# EAGLE design SparkFunVKeyVoltageKeypad2 (EAGLE 7.4.0)
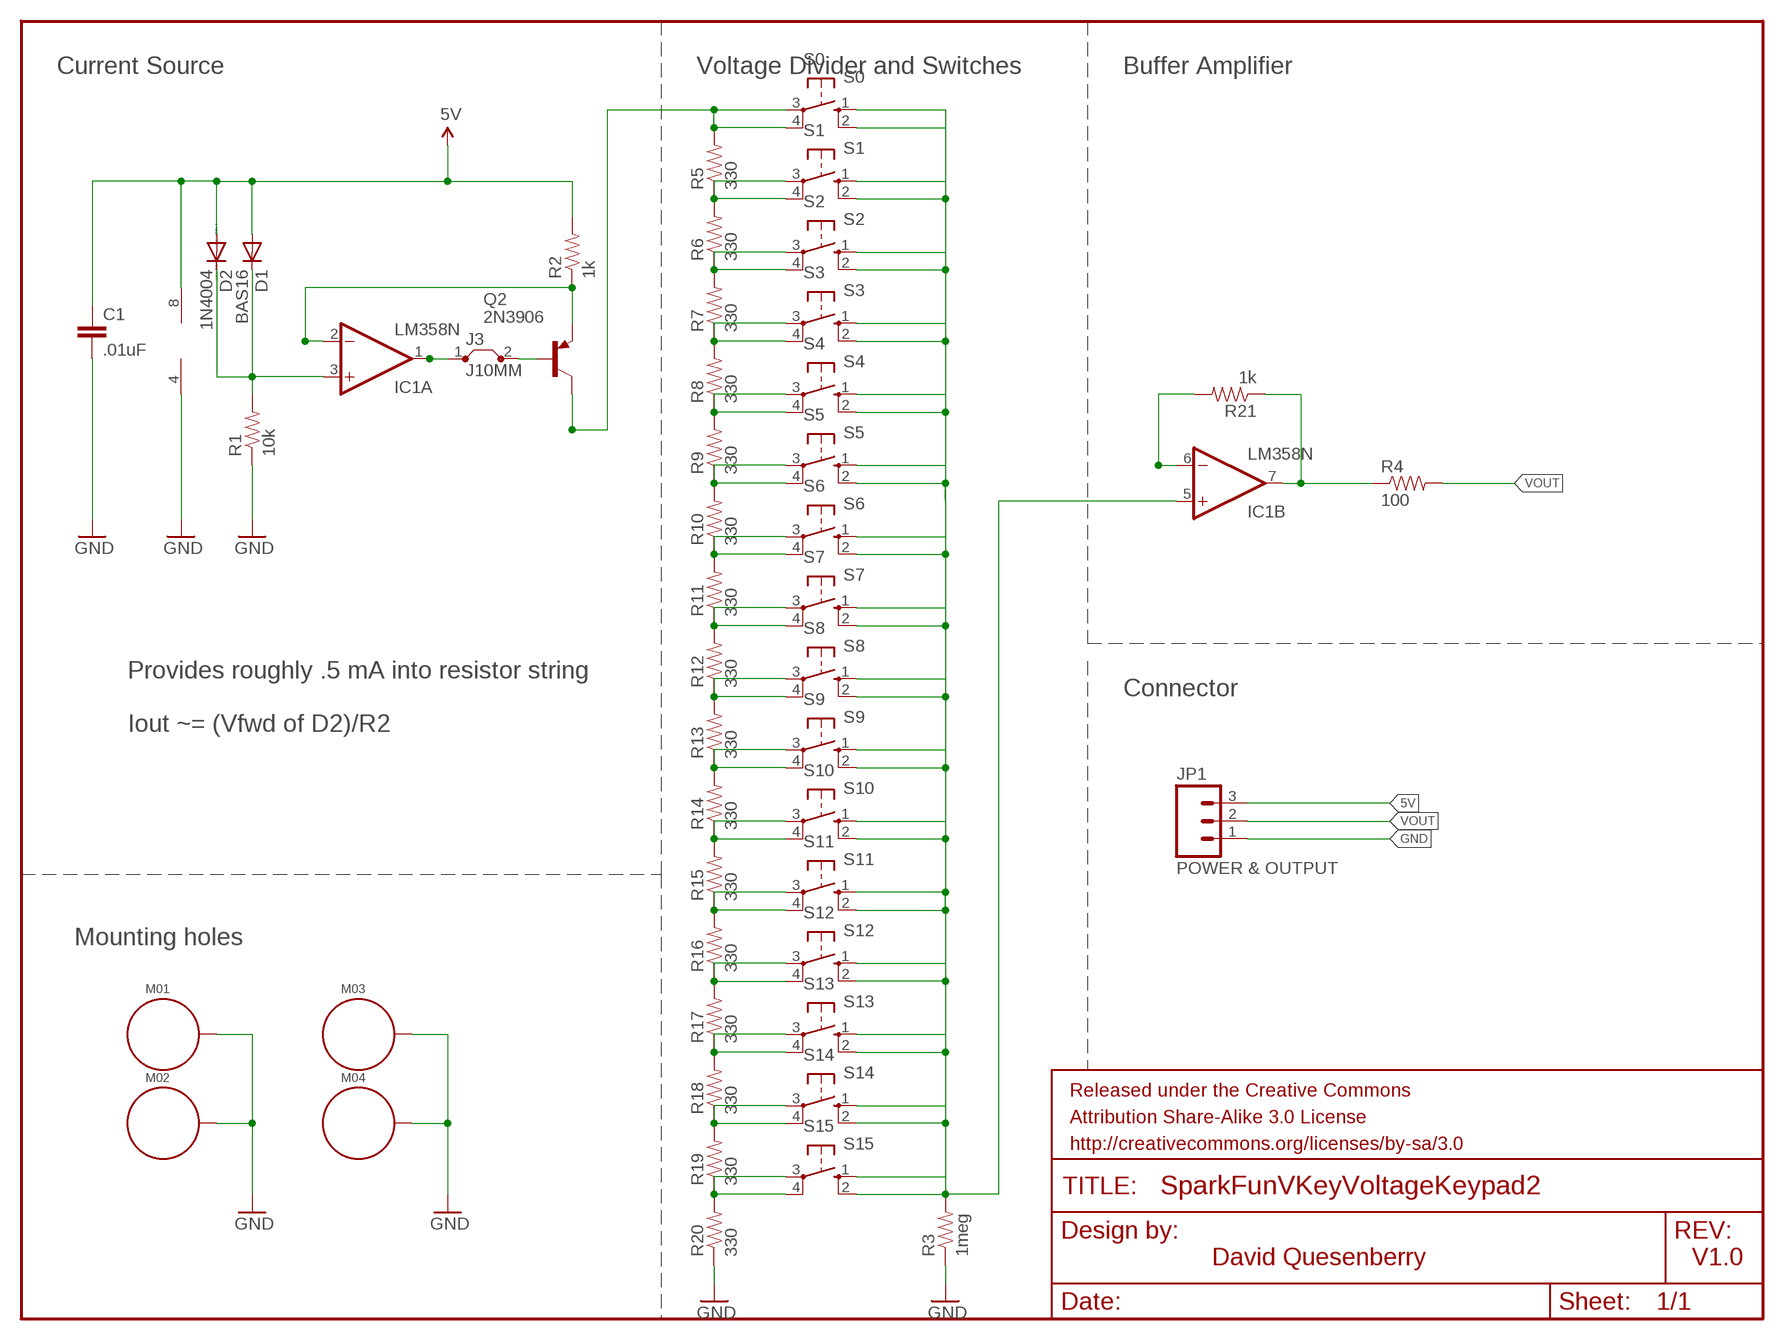
[diagram p0: schematic, sheet 1]

## Parts
C1  .01uF  10NF/10000PF-50V-10%(0603)  [0603-CAP]
D1  BAS16  DIODESOD  [SOD-323]
D2  1N4004  [DO41-10]
FRAME1  FRAME-LETTER  [CREATIVE_COMMONS]
IC1  LM358N  [DIL08]
J3  J10MM  [10]
JP1  POWER & OUTPUT  M031X03_NO_SILK  [1X03_NO_SILK]
M01  STANDOFF_ELECTRICAL  [STANDOFF-ELECTRICAL]
M02  STANDOFF_ELECTRICAL  [STANDOFF-ELECTRICAL]
M03  STANDOFF_ELECTRICAL  [STANDOFF-ELECTRICAL]
M04  STANDOFF_ELECTRICAL  [STANDOFF-ELECTRICAL]
Q2  2N3906  [TO92]
R1  10k  10KOHM1/10W1%(0603)0603  [0603-RES]
R2  1k  1KOHM1/10W1%(0603)  [0603-RES]
R3  1meg  1M-1%  [0603-RES]
R4  100  100OHM1/10W1%(0603)  [0603-RES]
R5  330  330OHM1/10W1%(0603)  [0603-RES]
R6  330  330OHM1/10W1%(0603)  [0603-RES]
R7  330  330OHM1/10W1%(0603)  [0603-RES]
R8  330  330OHM1/10W1%(0603)  [0603-RES]
R9  330  330OHM1/10W1%(0603)  [0603-RES]
R10  330  330OHM1/10W1%(0603)  [0603-RES]
R11  330  330OHM1/10W1%(0603)  [0603-RES]
R12  330  330OHM1/10W1%(0603)  [0603-RES]
R13  330  330OHM1/10W1%(0603)  [0603-RES]
R14  330  330OHM1/10W1%(0603)  [0603-RES]
R15  330  330OHM1/10W1%(0603)  [0603-RES]
R16  330  330OHM1/10W1%(0603)  [0603-RES]
R17  330  330OHM1/10W1%(0603)  [0603-RES]
R18  330  330OHM1/10W1%(0603)  [0603-RES]
R19  330  330OHM1/10W1%(0603)  [0603-RES]
R20  330  330OHM1/10W1%(0603)  [0603-RES]
R21  1k  1KOHM1/10W1%(0603)  [0603-RES]
S0  S0  10-XX  [B3F-10XX]
S1  S1  10-XX  [B3F-10XX]
S2  S2  10-XX  [B3F-10XX]
S3  S3  10-XX  [B3F-10XX]
S4  S4  10-XX  [B3F-10XX]
S5  S5  10-XX  [B3F-10XX]
S6  S6  10-XX  [B3F-10XX]
S7  S7  10-XX  [B3F-10XX]
S8  S8  10-XX  [B3F-10XX]
S9  S9  10-XX  [B3F-10XX]
S10  S10  10-XX  [B3F-10XX]
S11  S11  10-XX  [B3F-10XX]
S12  S12  10-XX  [B3F-10XX]
S13  S13  10-XX  [B3F-10XX]
S14  S14  10-XX  [B3F-10XX]
S15  S15  10-XX  [B3F-10XX]

## Nets
5V: C1.1 D1.2(A) D2.A IC1.8(P:V+) JP1.3 R2.2
GND: C1.2 IC1.4(P:V-) JP1.1 M01.P1 M02.P1 M03.P1 M04.P1 R1.1 R3.1 R20.1
N$1: D1.1(C) D2.C IC1.3(A:+IN) R1.2
N$2: J3.2 Q2.2(B)
N$3: IC1.5(B:+IN) R3.2 S0.1(S) S0.2(S1) S1.1(S) S1.2(S1) S2.1(S) S2.2(S1) S3.1(S) S3.2(S1) S4.1(S) S4.2(S1) S5.1(S) S5.2(S1) S6.1(S) S6.2(S1) S7.1(S) S7.2(S1) S8.1(S) S8.2(S1) S9.1(S) S9.2(S1) S10.1(S) S10.2(S1) S11.1(S) S11.2(S1) S12.1(S) S12.2(S1) S13.1(S) S13.2(S1) S14.1(S) S14.2(S1) S15.1(S) S15.2(S1)
N$4: R14.1 R15.2 S10.3(P) S10.4(P1)
N$5: IC1.2(A:-IN) Q2.3(E) R2.1
N$6: Q2.1(C) R5.2 S0.3(P) S0.4(P1)
N$7: R5.1 R6.2 S1.3(P) S1.4(P1)
N$8: R6.1 R7.2 S2.3(P) S2.4(P1)
N$9: R7.1 R8.2 S3.3(P) S3.4(P1)
N$10: R8.1 R9.2 S4.3(P) S4.4(P1)
N$11: R9.1 R10.2 S5.3(P) S5.4(P1)
N$12: R10.1 R11.2 S6.3(P) S6.4(P1)
N$13: R11.1 R12.2 S7.3(P) S7.4(P1)
N$14: R12.1 R13.2 S8.3(P) S8.4(P1)
N$15: R13.1 R14.2 S9.3(P) S9.4(P1)
N$16: R19.1 R20.2 S15.3(P) S15.4(P1)
N$17: IC1.7(B:OUT) R4.1 R21.1
N$18: IC1.6(B:-IN) R21.2
N$20: R15.1 R16.2 S11.3(P) S11.4(P1)
N$21: R16.1 R17.2 S12.3(P) S12.4(P1)
N$22: R17.1 R18.2 S13.3(P) S13.4(P1)
N$23: R18.1 R19.2 S14.3(P) S14.4(P1)
N$24: IC1.1(A:OUT) J3.1
VOUT: JP1.2 R4.2

## Notes on the sheet
- Current Source | Voltage Divider and Switches | Buffer Amplifier
- Provides roughly .5 mA into resistor string
- Connector
- Iout ~= (Vfwd of D2)/R2
- Mounting holes
- David Quesenberry | V1.0

## Library data of the parts
C1 = SparkFun-Capacitors:10NF/10000PF-50V-10%(0603): CAP-00867; PROD_ID: CAP-00867; VALUE: 10nF
D1 = SparkFun-DiscreteSemi:DIODE: Diode These are standard reverse protection diodes and small signal diodes. SMA package can handle up to about 1A. SOD-323 can handle about 200mA. What the SOD-323 package when ordering, there are some mfgs out there that are 5-pin packages.; PROD_ID: DIO-09646
D2 = diode:1N4004: DIODE general purpose rectifier, 1 A
FRAME1 = SparkFun-Aesthetics:FRAME-LETTER: Schematic Frame Standard 8.5x11 US Letter frame
IC1 = linear:LM358: OP AMP also LM158; LM258; LM2904 Source: http://cache.national.com/ds/LM/LM158.pdf
J3 = jumper:J: Bridge
JP1 = SparkFun-Connectors:M03: Header 3 Standard 3-pin 0.1" header. Use with straight break away headers (SKU : PRT-00116), right angle break away headers (PRT-00553), swiss pins (PRT-00743), machine pins (PRT-00117), and female headers (PRT-00115). Molex polarized connector foot print use with SKU : PRT-08232 with associated crimp pins and housings.
M01-M04 = SparkFun-Electromechanical:STANDOFF_ELECTRICAL: A standoff intended to be an electrically connected point. Pad size and stop size allow for a #4 Phillips pan screw head to make a solid connection to the board.
Q2 = transistor-pnp:2N3906: PNP Transistor
R1 = SparkFun-Resistors:10KOHM1/10W1%(0603): RES-00824; PROD_ID: RES-00824; VALUE: 10K
R2 R21 = SparkFun-Resistors:1KOHM1/10W1%(0603): RES-07856; PROD_ID: RES-07856; VALUE: 1K
R3 = SparkFun-Resistors:1M-1%: 1M-ohm SMT 1/10W - 1% (0603) RES-07868; PROD_ID: RES-07868; VALUE: 1M
R4 = SparkFun-Resistors:100OHM1/10W1%(0603): RES-07863; PROD_ID: RES-07863
R5-R20 = SparkFun-Resistors:330OHM1/10W1%(0603): RES-00818; PROD_ID: RES-00818
S0 S1-S15 = switch-omron:10-XX: OMRON SWITCH; MPN: B3F-1000; OC_FARNELL: 176432; OC_NEWARK: 36M3542

## Net classes
0 default: width 1.27 mm, drill 0.508 mm, clearance 0.635 mm

## Board
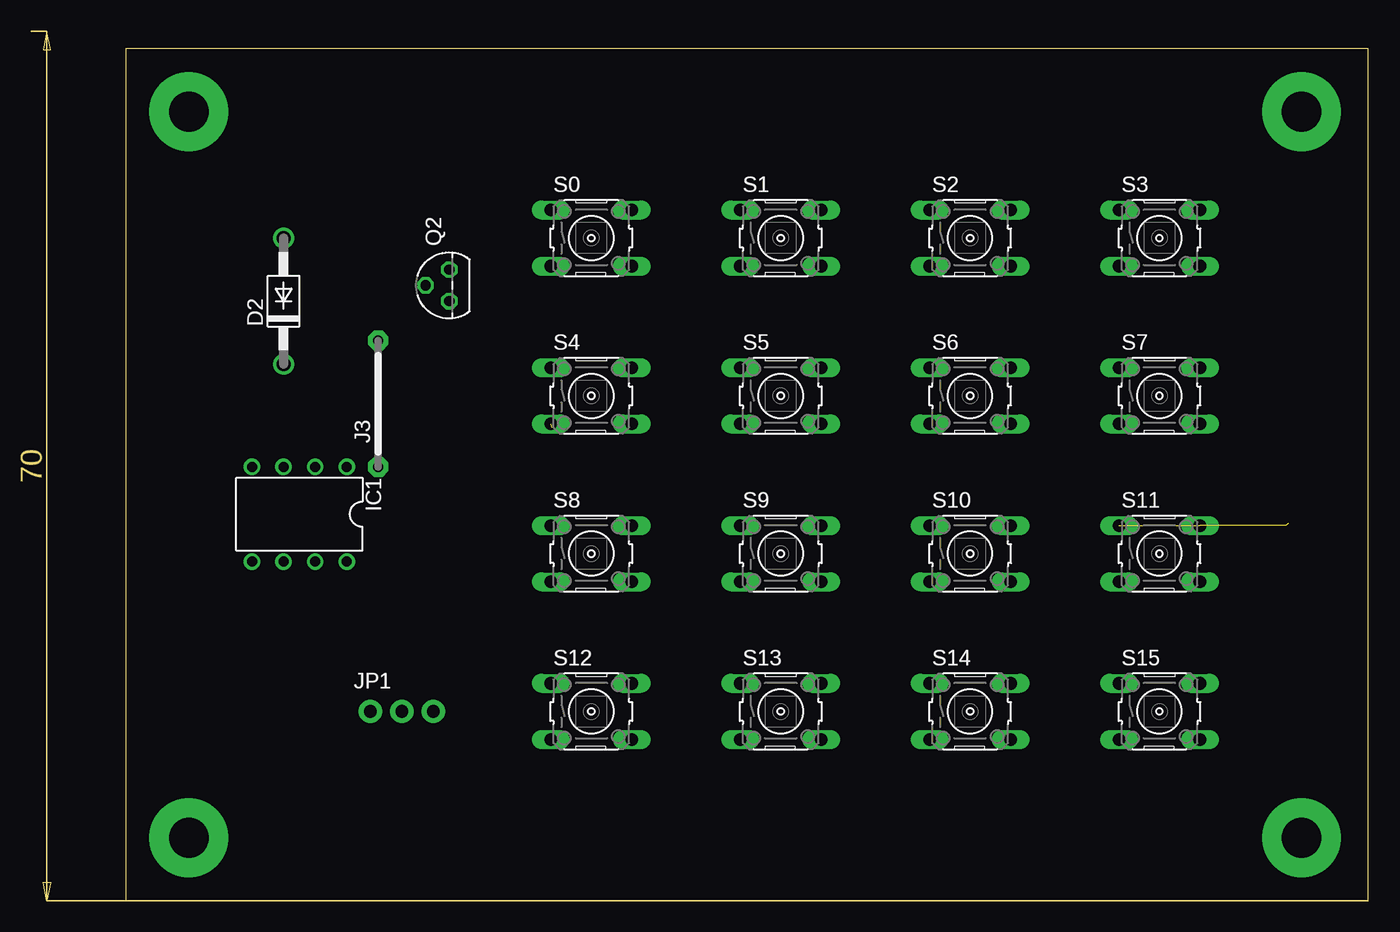
[diagram p1: board, top side]
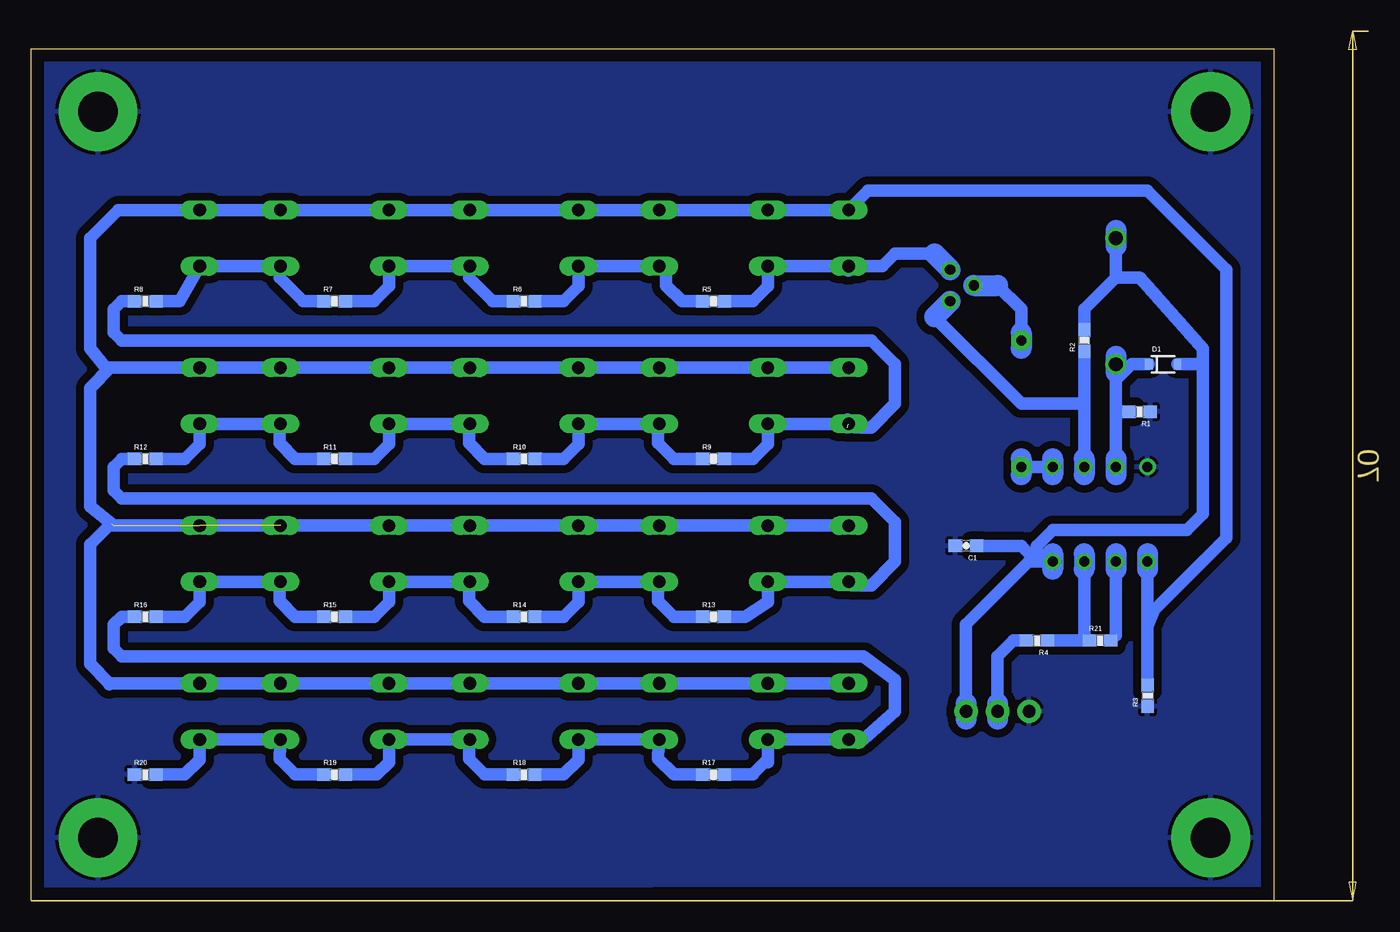
[diagram p2: board, bottom side, seen from below]

Size 100 x 68.57 mm. Coordinates in mm from the lower left corner, seen from the top.
Outline: 0,0 100,0 100,68.57 0,68.57 0,0
Copper layers (1*16): Top 0.035mm / dielectric 1.5mm / Bottom 0.035mm
Design rules "default": minimum track width 10mil, minimum drill 24mil, track to track 8mil, track to pad 8mil, pad to pad 8mil, via to via 8mil, smd to smd 8mil, copper to edge 40mil, drill to drill 8mil, minimum pad ring 10mil, minimum via ring 8mil, stop-mask expansion 4mil, vias tented up to drill 0mil, thermal gap 10mil

### Footprints (pad centres in the part's own frame; a part is rotated, then mirrored left to right if it is on the bottom)
0603-CAP = smd 1.1 x 1: 1 -0.85,0; 2 0.85,0
SOD-323 = smd 0.63 x 0.83: 1 -1.15,0; 2 1.15,0
DO41-10 = drill 1.118: A 5.08,0; C -5.08,0
DIL08 = drill 0.813 pad 1.27: 1 -3.81,-3.81; 2 -1.27,-3.81; 3 1.27,-3.81; 4 3.81,-3.81; 5 3.81,3.81; 6 1.27,3.81; 7 -1.27,3.81; 8 -3.81,3.81
10 = drill 0.813 pad 1.6 octagon: 1 -5.08,0; 2 5.08,0
1X03_NO_SILK = drill 1.016 pad 1.88: 1 0,0; 2 2.54,0; 3 5.08,0
STANDOFF-ELECTRICAL = drill 3.2 pad 6.35: P1 0,0
TO92 = drill 0.813 octagon: 1 1.27,0; 2 0,1.905; 3 -1.27,0
0603-RES = smd 1.1 x 1: 1 -0.85,0; 2 0.85,0
B3F-10XX = drill 1.016 long: 1 -3.251,2.261; 2 3.251,2.261; 3 -3.251,-2.261; 4 3.251,-2.261

### Placement (x,y rotation side)
C1  24.77,28.57 180 bottom
D1  8.89,43.18 0 bottom
D2  12.7,48.26 90 top
FRAME1  30.48,1.27 0 top
IC1  13.97,31.11 180 top
J3  20.32,40.01 90 top
JP1  19.68,15.24 0 top
M01  5.08,63.5 0 top
M02  94.61,63.5 0 top
M03  5.08,5.08 0 top
M04  94.61,5.08 0 top
Q2  26.04,49.53 90 top
R1  10.79,39.37 180 bottom
R2  15.24,45.09 90 bottom
R3  10.16,16.51 90 bottom
R4  19.05,20.95 180 bottom
R5  45.09,48.26 0 bottom
R6  60.33,48.26 0 bottom
R7  75.56,48.26 0 bottom
R8  90.81,48.26 0 bottom
R9  45.09,35.56 0 bottom
R10  60.33,35.56 0 bottom
R11  75.56,35.56 0 bottom
R12  90.81,35.56 0 bottom
R13  45.09,22.86 0 bottom
R14  60.33,22.86 0 bottom
R15  75.56,22.86 0 bottom
R16  90.81,22.86 0 bottom
R17  45.09,10.16 0 bottom
R18  60.33,10.16 0 bottom
R19  75.56,10.16 0 bottom
R20  90.81,10.16 0 bottom
R21  13.97,20.95 0 bottom
S0  37.47,53.34 0 top
S1  52.7,53.34 0 top
S2  67.94,53.34 0 top
S3  83.19,53.34 0 top
S4  37.47,40.64 0 top
S5  52.7,40.64 0 top
S6  67.94,40.64 0 top
S7  83.19,40.64 0 top
S8  37.47,27.94 0 top
S9  52.7,27.94 0 top
S10  67.94,27.94 0 top
S11  83.19,27.94 0 top
S12  37.47,15.24 0 top
S13  52.7,15.24 0 top
S14  67.94,15.24 0 top
S15  83.19,15.24 0 top

### Tracks (layer width: path | path; a pad name or v marks a point on that pad's centre or on a via)
5V
  Bottom 1.016: 5.71,43.18 5.71,31.11 6.99,29.84 17.78,29.84 19.05,28.57 19.05,27.3 | 5.71,43.18 D1.2 | R2.2 15.24,47.62 12.7,50.16 | 12.7,50.16 D2.A 12.7,53.98 | 12.7,50.16 10.79,50.16 5.71,44.45 5.71,43.18 | JP1.3 24.77,15.88 24.77,22.23 19.68,27.3 19.05,27.3 | 19.05,27.3 IC1.8 | C1.1 20.32,28.57 19.05,27.3
  Bottom 1.676: 24.77,15.88 24.77,14.61 | 12.7,53.98 12.7,52.7
GND
  pour Bottom: 0,68.58 100.33,68.58 100.33,0 0,0
N$1
  Bottom 1.016: IC1.3 12.7,35.56 12.7,39.37 | 12.7,39.37 R1.2 | D1.1 11.43,43.18 12.7,41.91 | 12.7,41.91 12.7,39.37 | D2.C 12.7,42.55 12.7,41.91
  Bottom 1.676: 12.7,35.56 12.7,34.29 | 12.7,43.81 12.7,42.55
N$2
  Bottom 1.016: J3.2 20.32,44.45 | 20.32,45.72 20.32,47.62 22.23,49.53
  Bottom 1.676: 20.32,45.72 20.32,44.45 | Q2.2 22.23,49.53
N$3  (3 unrouted)
  Bottom 1.016: S10.2 S10.1 S9.2 S9.1 S8.2 S8.1 93.34,30.2 95.25,31.75 95.25,41.27 93.62,42.9 S7.1 | S7.1 S7.2 93.98,42.9 95.25,44.45 95.25,53.34 92.99,55.6 S3.2 S3.1 S2.2 S2.1 S1.2 S1.1 S0.2 S0.1 32.66,57.15 10.16,57.15 3.81,50.8 3.81,29.21 9.67,23.35 10.16,22.08 | S7.1 S6.2 S6.1 S5.2 S5.1 S4.2 S4.1 | S12.1 S12.2 S13.1 S13.2 S14.1 S14.2 S15.1 S15.2 93.7,17.5 | 93.7,17.5 95.25,19.05 95.25,28.67 93.55,30.37 | IC1.5 10.16,26.67 10.16,22.08 | 93.7,17.42 93.7,17.5 | R3.2 10.16,22.08
  Bottom 1.676: 10.16,27.94 10.16,26.67
N$4
  Bottom 1.016: R14.1 63.5,22.86 64.77,24.13 64.77,25.6 S10.3 S10.4 71.2,24.05 72.39,22.86 R15.2
N$5
  Bottom 1.016: IC1.2 15.24,35.56 15.24,40.01 | 15.24,40.01 R2.1 | 15.24,40.01 20.32,40.01 27.3,46.99
  Bottom 1.676: 15.24,35.56 15.24,34.29 | Q2.3 27.3,46.99
N$6
  Bottom 1.016: S0.3 S0.4 40.72,49.45 41.91,48.26 R5.2 | S0.3 34.21,50.72 | S0.3 31.47,51.08 30.48,52.07 27.3,52.07
  Bottom 1.676: Q2.1 27.3,52.07
N$7
  Bottom 1.016: R5.1 47.62,48.26 48.9,49.53 48.9,50.52 S1.3 S1.4 55.96,49.45 57.15,48.26 R6.2
N$8
  Bottom 1.016: R6.1 62.87,48.26 64.77,50.16 64.77,51 S2.3 S2.4 71.2,49.45 72.39,48.26 R7.2
N$9
  Bottom 1.016: R7.1 78.11,48.26 80.01,50.16 80.01,51 S3.3 S3.4 88.05,48.26 R8.2
N$10  (1 unrouted)
  Bottom 1.016: R8.1 92.71,48.26 93.34,47.62 93.34,45.72 92.71,45.09 32.38,45.09 30.48,43.18 30.48,40.01 32.38,38.1 33.66,38.1 34.29,38.73 | 34.29,38.73 34.29,38.1 | 34.29,38.73 34.65,38.38 S4.4 40.72,36.75 41.91,35.56 R9.2
N$11
  Bottom 1.016: R9.1 48.26,35.56 49.53,36.83 49.53,38.3 S5.3 S5.4 55.96,36.75 57.15,35.56 R10.2
N$12
  Bottom 1.016: R10.1 63.5,35.56 64.77,36.83 64.77,38.3 S6.3 S6.4 71.2,36.75 72.39,35.56 R11.2
N$13
  Bottom 1.016: R11.1 78.74,35.56 80.01,36.83 80.01,38.3 S7.3 S7.4 86.44,36.75 87.63,35.56 R12.2
N$14
  Bottom 1.016: R12.1 92.71,35.56 93.34,34.92 93.34,33.02 92.71,32.38 32.38,32.38 30.48,30.48 30.48,27.3 32.38,25.4 33.93,25.4 S8.3 S8.4 40.72,24.05 42.55,22.86 R13.2
N$15
  Bottom 1.016: R13.1 48.26,22.86 49.53,24.13 49.53,25.6 S9.3 S9.4 55.96,24.05 57.15,22.86 R14.2
N$16
  Bottom 1.016: R19.1 78.74,10.16 80.01,11.43 80.01,11.63 S15.3 S15.4 86.44,11.35 87.63,10.16 R20.2
N$17
  Bottom 1.016: IC1.7 15.24,26.67 15.24,21.38 R21.1 R4.1
  Bottom 1.676: 15.24,27.94 15.24,26.67
N$18
  Bottom 1.016: IC1.6 12.7,26.67 12.7,21.38 R21.2
  Bottom 1.676: 12.7,27.94 12.7,26.67
N$19
  Bottom 1.676: 17.78,35.56 17.78,34.29
N$20
  Bottom 1.016: R15.1 78.74,22.86 80.01,24.13 80.01,25.6 S11.3 S11.4 86.44,24.05 87.63,22.86 R16.2
N$21
  Bottom 1.016: R16.1 92.71,22.86 93.34,22.23 93.34,20.32 92.71,19.68 33.02,19.68 30.48,17.78 30.48,15.24 33.02,12.98 S12.3 S12.4 40.72,11.43 | 40.72,11.43 40.72,11.14 | R17.2 41.91,10.16 41.91,10.24 40.72,11.43
N$22
  Bottom 1.016: R17.1 48.26,10.16 49.53,11.43 49.53,11.63 S13.3 S13.4 55.96,11.35 57.15,10.16 R18.2
N$23
  Bottom 1.016: R18.1 63.5,10.16 64.77,11.43 64.77,11.63 S14.3 S14.4 71.2,11.14 72.17,10.16 R19.2
N$24
  Bottom 1.016: IC1.1 J3.1
N$25
  Bottom 1.676: 20.32,35.56 20.32,34.29
N$26
  Bottom 1.676: 17.78,27.94 17.78,26.67
VOUT
  Bottom 1.016: JP1.2 22.23,15.88 22.23,19.68 20.95,20.95 R4.2
  Bottom 1.676: 22.23,15.88 22.23,14.61

### Text on the board
_tNames: S0 | S1 | S2 | S3 | Q2 | D2 | S4 | S5 | S6 | S7 | J3 | IC1 | S8 | S9 | S10 | S11 | S12 | S13 | S14 | S15 | JP1
_bNames: R5 | R6 | R7 | R8 | D1 | R2 | R1 | R9 | R10 | R11 | R12 | C1 | R13 | R14 | R15 | R16 | R21 | R4 | R3 | R17 | R18 | R19 | R20
_tValues: S0 | S1 | S2 | S3 | S4 | S5 | S6 | S7 | S8 | S9 | S10 | S11 | S12 | S13 | S14 | S15